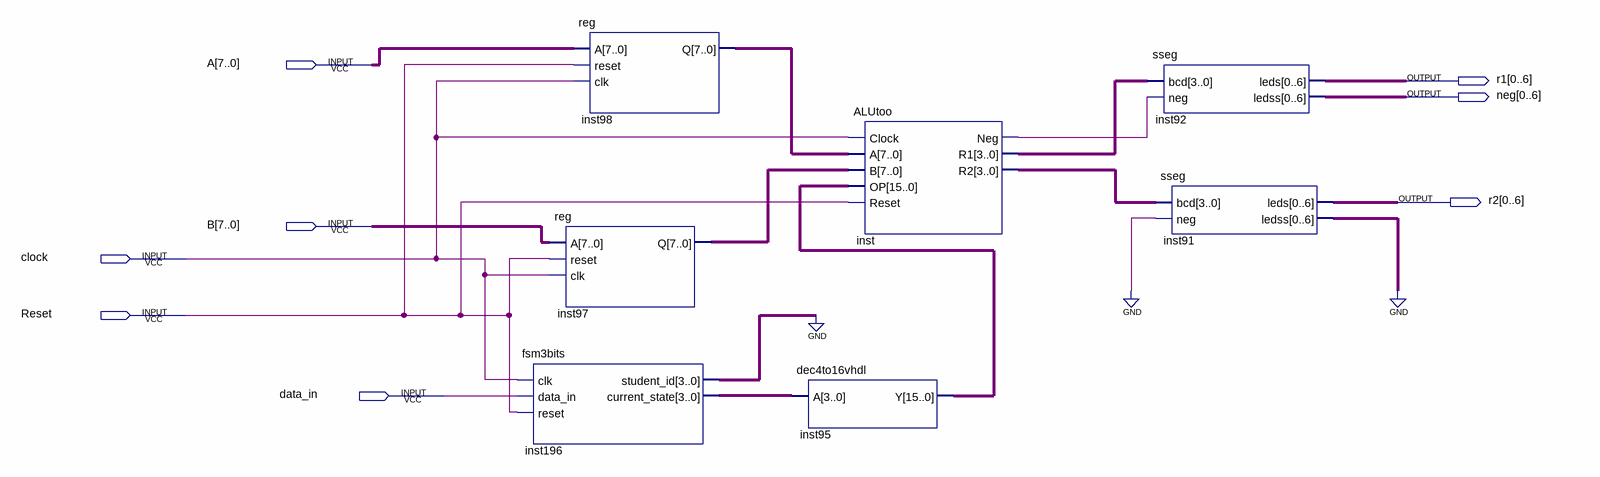
[diagram p0: schematic sheet]
// Quartus schematic Combined2.bdf as structural Verilog: 7 symbols, 8 pins
module Combined2 (
  input  [7:0] A,
  input  [7:0] B,
  input  clock,
  input  Reset,
  input  data_in,
  output [0:6] r1,
  output [0:6] neg,
  output [0:6] r2
);

  wire inst_neg;
  wire [3:0] inst196_current_state, inst196_student_id, inst_r1, inst_r2;
  wire [6:0] inst91_ledss;
  wire [7:0] inst97_q, inst98_q;
  wire [15:0] inst95_y;

  fsm3bits inst196 (
    .clk(clock), .data_in(data_in), .reset(Reset), .student_id(inst196_student_id),
    .current_state(inst196_current_state));
  \reg  inst98 (.A(A), .reset(Reset), .clk(clock), .Q(inst98_q));
  \reg  inst97 (.A(B), .reset(Reset), .clk(clock), .Q(inst97_q));
  dec4to16vhdl inst95 (.A(inst196_current_state), .Y(inst95_y));
  ALUtoo inst (
    .Clock(clock), .A(inst98_q), .B(inst97_q), .OP(inst95_y), .Reset(Reset), .Neg(inst_neg), .R1(inst_r1),
    .R2(inst_r2));
  sseg inst92 (.bcd(inst_r1), .neg(inst_neg), .leds(r1), .ledss(neg));
  sseg inst91 (.bcd(inst_r2), .neg(1'b0), .leds(r2), .ledss(inst91_ledss));
  // also tied to GND on the sheet: {inst196_student_id[0], inst196_student_id[1], inst196_student_id[2], inst196_student_id[3], inst91_ledss[0], inst91_ledss[1], inst91_ledss[2], inst91_ledss[3], inst91_ledss[4], inst91_ledss[5], inst91_ledss[6]}
endmodule
